# EAGLE design WiiCam (EAGLE 6.1)
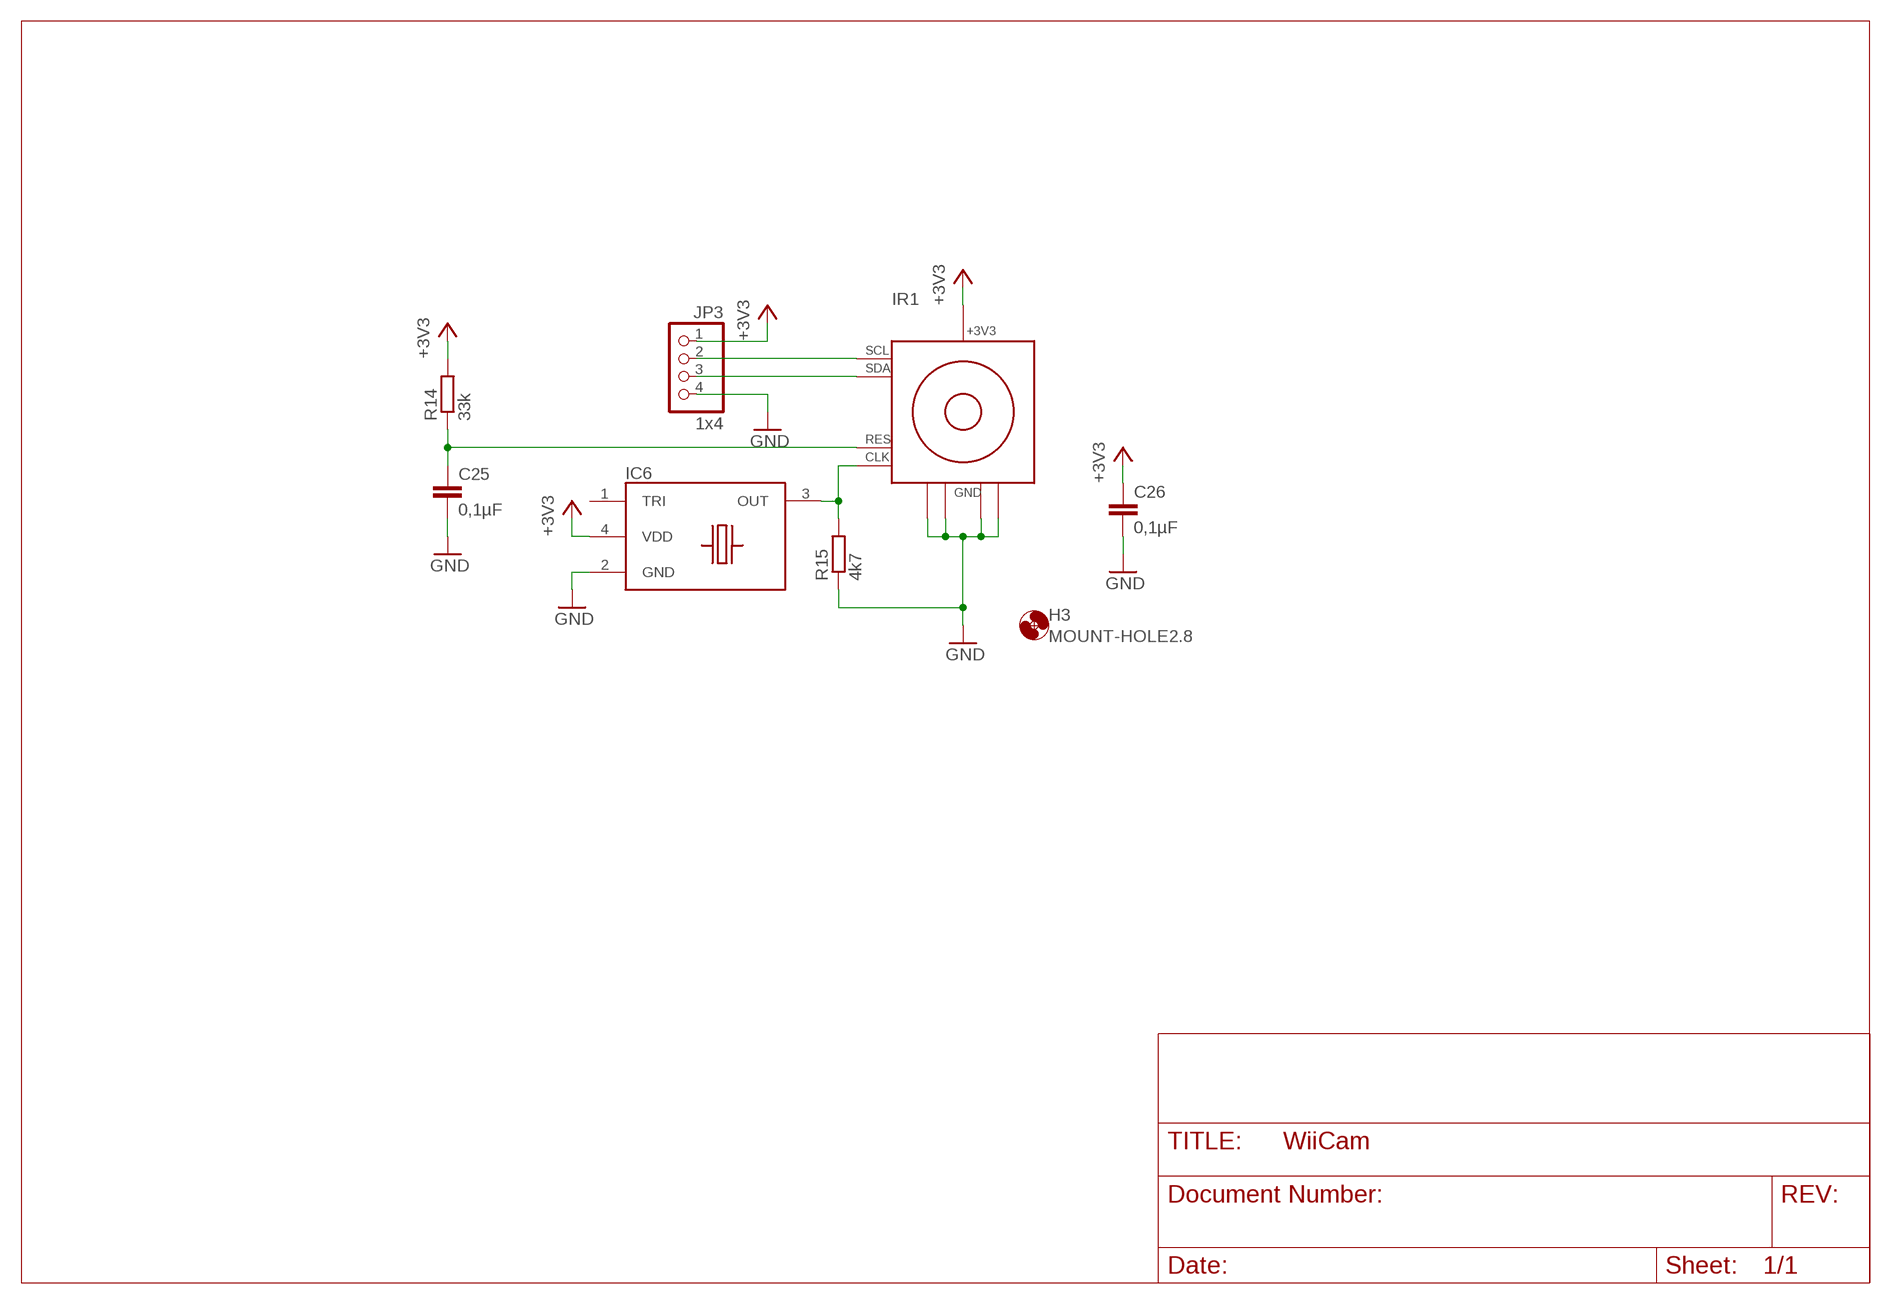
[diagram p0: schematic, sheet 1]

## Parts
C25  0,1µF  C-EUC0805  [C0805]
C26  0,1µF  C-EUC0805  [C0805]
H3  MOUNT-HOLE2.8  [2,8]
IC6  7W-25.000MBB-T  TXC_7W  [SMD_7X5MM]
IR1  OWN_WII_IR_SENSOR  [OWN_WII_IR_SENSOR]
JP3  1x4  PINHD-1X4  [1X04]
R14  33k  R-EU_R0805  [R0805]
R15  4k7  R-EU_R0805  [R0805]

## Nets
+3V30: C26.1 IC6.4(VDD) IR1.1_+3V3(+3V3) JP3.1 R14.2 ; supply symbol labelled +3V3
GND: C25.2 C26.2 IC6.2(GND) IR1.2_GND@1(GND) IR1.3_GND@2(GND) IR1.GND@3(GND) IR1.GND@4(GND) JP3.4 R15.1
OUT: IC6.3(OUT) IR1.7_CLK(CLK) R15.2
RES: C25.1 IR1.8_RESET(RES) R14.1
SCL1: IR1.5_SCL(SCL) JP3.2
SDA1: IR1.6_SDA(SDA) JP3.3
Unconnected: IC6.1(TRI)

## Library data of the parts
C25 C26 = rcl:C-EU: CAPACITOR, European symbol
H3 = holes:MOUNT-HOLE: MOUNTING HOLE with drill center marker
IC6 = Sensorboard:TXC_7W: 7x5mm SMD Oscillator TXC 7x5 mm SMD CMOS CXO 7W Series
IR1 = Sensorboard:OWN_WII_IR_SENSOR
JP3 = pinhead:PINHD-1X4: PIN HEADER
R14 R15 = rcl:R-EU_: RESISTOR, European symbol

## Board
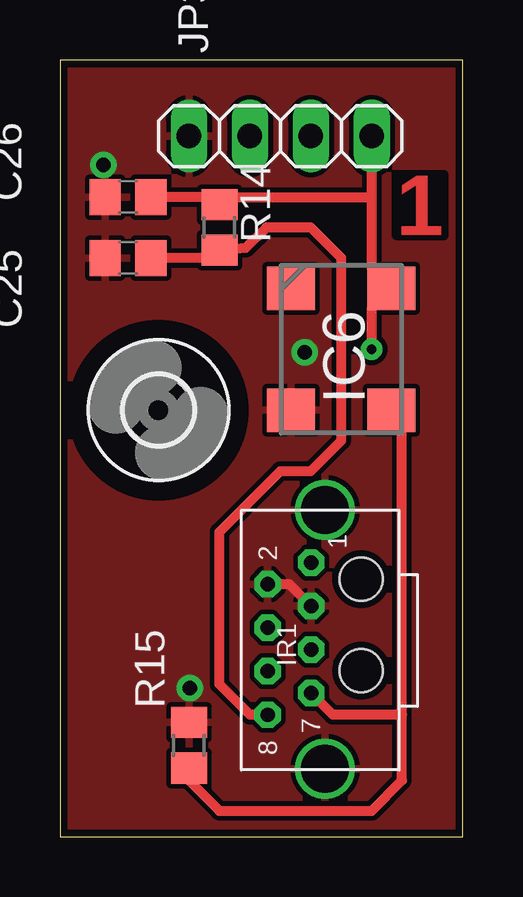
[diagram p1: board, top side]
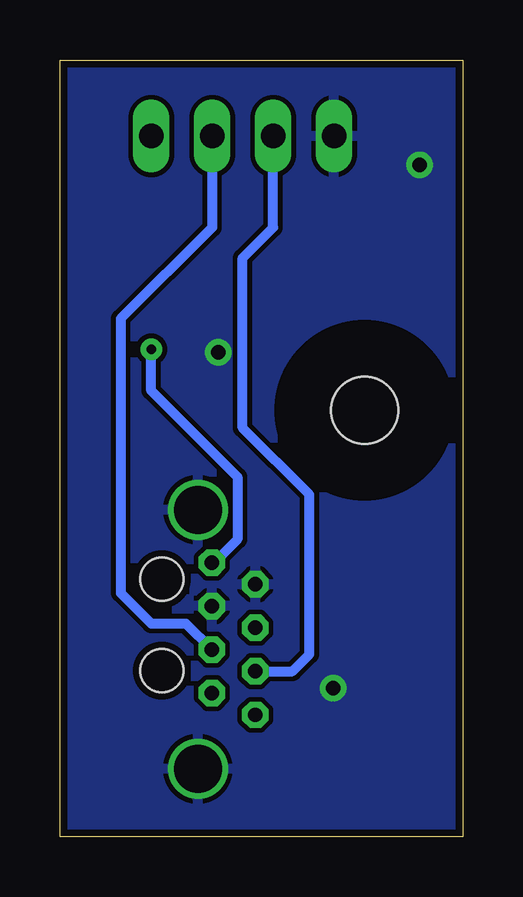
[diagram p2: board, bottom side, seen from below]

Size 16.81 x 32.38 mm. Coordinates in mm from the lower left corner, seen from the top.
Outline: 16.81,0 16.81,32.38 0,32.38 0,0 16.81,0
Copper layers (1*16): Top 0.035mm / dielectric 1.5mm / Bottom 0.035mm
Design rules: minimum track width 0.2mm, minimum drill 0.3mm, track to track 0.19mm, track to pad 0.19mm, pad to pad 0.17mm, via to via 0.19mm, smd to smd 0mil, copper to edge 0.3mm, drill to drill 0.2mm, minimum pad ring 0.25mm, minimum via ring 0.25mm, stop-mask expansion 0.075mm, vias tented up to drill 0.6mm, thermal gap 0.2mm

### Footprints (pad centres in the part's own frame; a part is rotated, then mirrored left to right if it is on the bottom)
C0805 = smd 1.3 x 1.5: 1 -0.95,0; 2 0.95,0
2,8 = hole 2.8: 0,0
SMD_7X5MM = smd 1.8 x 2: 1 -2.54,-2.1; 2 2.54,-2.1; 3 2.54,2.1; 4 -2.54,2.1
OWN_WII_IR_SENSOR = drill 0.6 octagon: 1_+3V3 0,0.014; 2_GND@1 0.907,-1.8; 3_GND@2 1.814,0.014; 4_NC 2.721,-1.8; 5_SCL 3.629,0.014; 6_SDA 4.536,-1.8; 7_CLK 5.443,0.014; 8_RESET 6.35,-1.8 | drill 2: GND@3 -2.2,0.6; GND@4 8.6,0.6 | hole 1.8: 4.5,2.1; 0.7,2.1
1X04 = drill 1.016 long: 1 -3.81,0; 2 -1.27,0; 3 1.27,0; 4 3.81,0
R0805 = smd 1.3 x 1.5: 1 -0.95,0; 2 0.95,0

### Placement (x,y rotation side)
C25  2.84,24.13 180 top
C26  2.84,26.67 180 top
H3  4.11,17.78 90 top
IC6  11.73,20.32 270 top
IR1  10.46,11.43 270 top
JP3  9.19,29.21 180 top
R14  6.65,25.4 90 top
R15  5.38,3.81 270 top

### Tracks (layer width: path | path; a pad name or v marks a point on that pad's centre or on a via)
+3V30  (via drill 0.4 pad 0.81)
  Top 0.406: v13,20.32 13,22.03 IC6.4 13,23.69 13,26.67 | 13,26.67 7.07,26.67 7.07,26.35 R14.2 6.65,26.67 C26.1 | 13,26.67 13.01,26.67 JP3.1
  Bottom 0.406: v13,20.32 13,18.59 9.41,15 9.41,12.4 10.41,11.4 10.44,11.4 IR1.1_+3V3
GND  (via drill 0.6)
  Top 0.406: IR1.3_GND@2 9.57,10.52 IR1.2_GND@1
  other vias: 5.41,6.2 10.21,20.2 1.81,28
  pour Top (isolate 0.2): 0.3,0 16.81,0 16.81,32.39 0.3,32.39
  pour Bottom (isolate 0.2): 16.81,0 16.81,32.39 0.3,32.39 0.3,0
OUT
  Top 0.406: R15.2 5.38,2.34 6.65,1.07 13,1.07 14.27,2.34 14.27,5.08 | IR1.7_CLK 11.38,5.08 14.27,5.08 | 14.27,5.08 14.27,17.34 IC6.3
RES
  Top 0.406: C25.1 6.23,24.13 R14.1 7.76,24.55 8.61,25.4 10.46,25.4 11.73,24.13 11.73,16.51 10.46,15.24 9.19,15.24 6.65,12.7 6.65,6.35 7.92,5.08 IR1.8_RESET
SCL1
  Bottom 0.406: JP3.2 10.46,25.4 14.27,21.59 14.27,10.16 13,8.89 11.56,8.89 IR1.5_SCL
SDA1
  Bottom 0.406: JP3.3 7.92,25.4 9.19,24.13 9.19,17.04 6.41,14.26 6.41,7.6 7.12,6.89 IR1.6_SDA

### Text on the board
Top: 1